# Altium schematic sheet 6_I2C_Sensors.SchDoc: I2C_Sensors
size A4; ApprovedBy: Alcatraz; CheckedBy: Alcatraz; Author: Alcatraz; CompanyName: DHNLAB; DrawnBy: Alcatraz; Engineer: Alcatraz; Organization: DHNLAB PVT LTD; Address1: DHANBAD; Address2: JHARKHAND; Address3: INDIA; Address4: ASIA; DocumentNumber: 6; Revision: 1.0; SheetNumber: 6; SheetTotal: 10; ProjectTitle: ESP8266-Deskop_Power
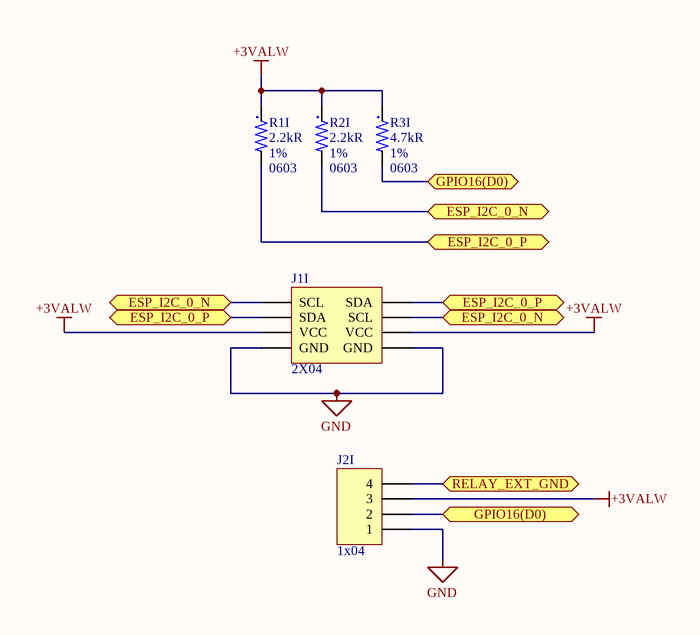
[diagram p0: 6_I2C_Sensors.SchDoc]

## Parts
J1I  2X04  [PinHeader_2x04_P2.54mm_Vertical]
J2I  1x04  [PinHeader_1x04_P2.54mm_Vertical]
R1I  value 2.2kR  Tolerance: 1%  Case/Package: 0603  [R0603-MFG]  (hidden comment: RC0603FR-072K2L)
R2I  value 2.2kR  Tolerance: 1%  Case/Package: 0603  [R0603-MFG]  (hidden comment: RC0603FR-072K2L)
R3I  value 4.7kR  Tolerance: 1%  Case/Package: 0603  [R0603-MFG]  (hidden comment: AC0603FR-074K7L)

## Ports
ESP_I2C_0_N (bidir, see 4_ESP32-Core[1C], 9_I2C & I2S[2A], 9_I2C & I2S[2B]), ESP_I2C_0_P (bidir, see 4_ESP32-Core[1C], 9_I2C & I2S[2A], 9_I2C & I2S[2B]), GPIO16(D0) (bidir, see 3_ESP8266_Core[4B]), RELAY_EXT_GND (bidir, see 3_ESP8266_Core[4B])

## Nets
+3VALW: J1I.3(VCC) J1I.4(VCC) J2I.3 R1I.1 R2I.1 R3I.1
GND: J1I.1(GND) J1I.2(GND) J2I.1
ESP_I2C_0_N: J1I.5(SCL) J1I.8(SCL) R2I.2 ; port ESP_I2C_0_N
ESP_I2C_0_P: J1I.6(SDA) J1I.7(SDA) R1I.2 ; port ESP_I2C_0_P
GPIO16(D0): J2I.2 R3I.2 ; port GPIO16(D0)
RELAY_EXT_GND: J2I.4 ; port RELAY_EXT_GND

## Notes on the sheet
- Title:
- Author:
- Approved:
- Size:
- Date:
- Git Hash:
- A4
- Prj:
- SW Version:
- Variant:
- Edited:
- PUBLIC
- File:

## Library data of the parts
J1I = I2C_2X04_P2.54mm
J2I = PinHeader 1x04
R1I R2I = 2.2K: SMD Chip Resistor, 2.2 kOhm, ± 1%, 100 mW, 0603 [1608 Metric], Thick Film, General Purpose; Manufacturer: Yageo; Power Rating: 100mW; Voltage Rating: 50V; Temperature Coefficient: 100ppm/°C; Supplier 1: Future Electronics; Manufacturer Part Number: RC0603FR-072K2L; RoHS: Yes; Category: Chip SMD Resistors; Stock 1: 6755000; Pricing 1: 5000=0.0026, 75000=0.001, 100000=0.0024, 200000=0.001, 375000=0.0023, 500000=0.0009, 1250000=0.0022, 5000000=0.002 (USD); Case Code (Imperial): 0603; Case Code (Metric): 1608; Min Operating Temperature: -55°C; Max Operating Temperature: 155°C; Packaging: Tape and Reel; Resistor Type: Thick Film; Number of Terminations: 2; Max Power Dissipation: 100mW; Features: Moisture Resistant; Series: RC; Resistance Tolerance: 1%; Lead Free: Lead Free; RoHS Compliant: Yes; Reach SVHC Compliant: Unknown; ComponentLink1URL: https://datasheet.ciiva.com/2453/pyu-r-int-thick-7-2453943.pdf?src-supplier=Digikey; ComponentLink1Description: https://datasheet.ciiva.com/2453/pyu-r-int-thick-7-2453943.pdf?src-supplier=Digikey; ComponentLink2URL: https://datasheet.ciiva.com/2453/pyu-r-int-thick-7-2453944.pdf?src-supplier=Digikey; ComponentLink2Description: https://datasheet.ciiva.com/2453/pyu-r-int-thick-7-2453944.pdf?src-supplier=Digikey; ComponentLink3URL: https://datasheet.ciiva.com/2453/pyu-r-int-thick-7-2453945.pdf?src-supplier=Digikey; ComponentLink3Description: https://datasheet.ciiva.com/2453/pyu-r-int-thick-7-2453945.pdf?src-supplier=Digikey; ComponentLink4URL: https://datasheet.ciiva.com/7660/1868787-7660791.pdf?src-supplier=Element14; ComponentLink4Description: https://datasheet.ciiva.com/7660/1868787-7660791.pdf?src-supplier=Element14; ComponentLink5URL: https://datasheet.ciiva.com/46394/443971-46394958.pdf?src-supplier=Element14; ComponentLink5Description: https://datasheet.ciiva.com/46394/443971-46394958.pdf?src-supplier=Element14; Supplier Part Number 1: 6372452
R3I = 4.7K: SMD Chip Resistor, 4.7 kOhm, ± 1%, 100 mW, 0603 [1608 Metric], Thick Film, General Purpose; Manufacturer: Yageo; Power Rating: 100mW; Voltage Rating: 50V; Temperature Coefficient: 100ppm/°C; Supplier 1: Future Electronics; Manufacturer Part Number: AC0603FR-074K7L; RoHS: Yes; Category: Chip SMD Resistors; Stock 1: 3030000; Pricing 1: 5000=0.0033, 25000=0.0031, 125000=0.0029, 250000=0.0028, 750000=0.0026 (USD); Case Code (Imperial): 0603; Case Code (Metric): 1608; Min Operating Temperature: -55°C; Max Operating Temperature: 155°C; Packaging: Tape and Reel; Number of Terminations: 2; Max Power Dissipation: 100mW; Features: Moisture Resistant,Automotive AEC-Q200; Series: AC; Lead Free: Lead Free; RoHS Compliant: Yes; ComponentLink1URL: https://datasheet.octopart.com/AC0603FR-074K7L-Yageo-datasheet-166720450.pdf?src-supplier=Future+Electronics; ComponentLink1Description: https://datasheet.octopart.com/AC0603FR-074K7L-Yageo-datasheet-166720450.pdf?src-supplier=Future+Electronics; ComponentLink2URL: http://www.yageo.com/NewPortal/yageodocoutput?fileName=/pdf/R-Chip/PYu-AC_51_RoHS_L_6.pdf&src-supplier=Mouser; ComponentLink2Description: http://www.yageo.com/NewPortal/yageodocoutput?fileName=/pdf/R-Chip/PYu-AC_51_RoHS_L_6.pdf&src-supplier=Mouser; ComponentLink3URL: http://www.yageo.com/documents/recent/PYu-AC_51_RoHS_L_2_revised.pdf?src-supplier=Future+Electronics; ComponentLink3Description: http://www.yageo.com/documents/recent/PYu-AC_51_RoHS_L_2_revised.pdf?src-supplier=Future+Electronics; ComponentLink4URL: http://www.yageo.com/NewPortal/yageodocoutput?fileName=/pdf/R-Chip/PYu-AC_51_RoHS_L_6.pdf&src-supplier=TTI; ComponentLink4Description: http://www.yageo.com/NewPortal/yageodocoutput?fileName=/pdf/R-Chip/PYu-AC_51_RoHS_L_6.pdf&src-supplier=TTI; Supplier Part Number 1: 2029294; Termination: SMD/SMT; Ratings: AEC-Q200